# EAGLE design cradle_venus (EAGLE 9.6.2)
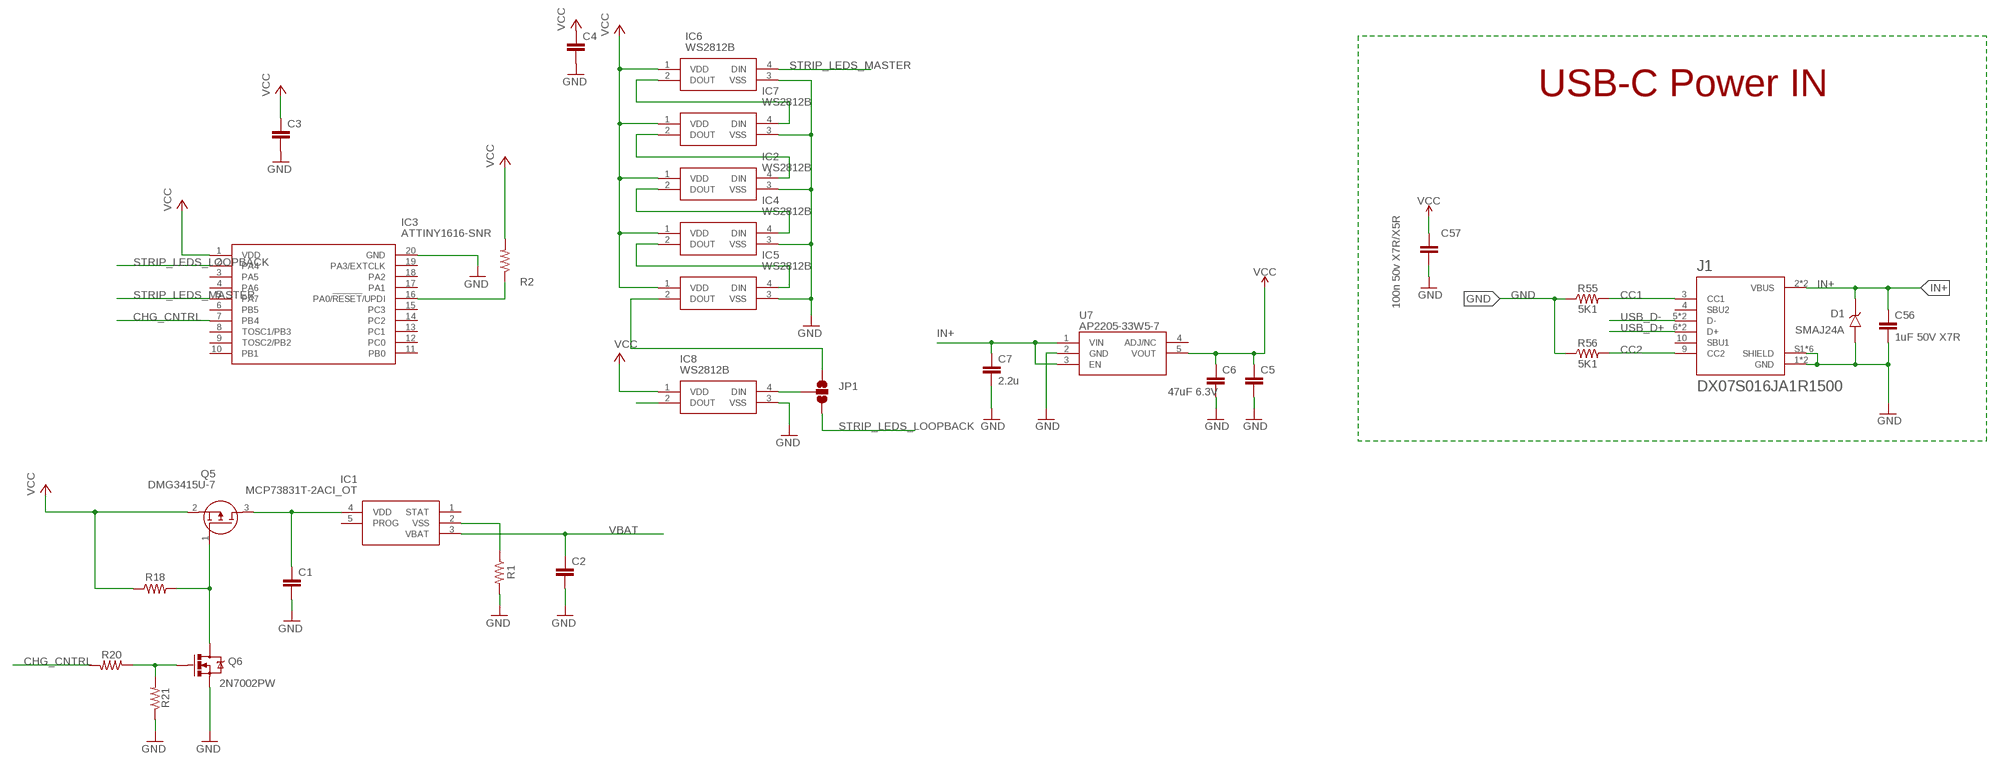
[diagram p0: schematic, sheet 1]

## Parts
C1  C-EUC0805  [C0805]
C2  C-EUC0805  [C0805]
C3  C-EUC0805  [C0805]
C4  C-EUC0805  [C0805]
C5  C-EUC0805  [C0805]
C6  47uF 6.3V  4.7UF-6.3V-10%(0603)0603  [0603-CAP]
C7  2.2u  4.7UF-6.3V-10%(0603)0603  [0603-CAP]
C56  1uF 50V X7R  CAP0805  [0805]
C57  100n 50v X7R/X5R  CAP0805  [0805]
D1  SMAJ24A  3SMAJ5934B  [DIOM4325X244N]
IC1  MCP73831T-2ACI_OT  [SOT95P270X145-5N]
IC2  WS2812B  [WS2812B]
IC3  ATTINY1616-SNR  [SOIC127P1030X265-20N]
IC4  WS2812B  [WS2812B]
IC5  WS2812B  [WS2812B]
IC6  WS2812B  [WS2812B]
IC7  WS2812B  [WS2812B]
IC8  WS2812B  [WS2812B]
J1  DX07S016JA1R1500  [JAE_DX07S016JA1R1500]
JP1  JUMPER-SMT_3_NO_SILK  [SMT-JUMPER_3_NO_SILK]
Q5  DMG3415U-7  SSM3J338R,LF  [SSM3J332RLFT]
Q6  2N7002PW  MOSFET-NCHANNEL2N7002PW  [SOT323]
R1  RESISTOR0805  [0805]
R2  RESISTOR0805  [0805]
R18  RESISTOR0805  [0805]
R20  RESISTOR0805  [0805]
R21  RESISTOR0805  [0805]
R55  5K1  RESISTOR0805  [0805]
R56  5K1  RESISTOR0805  [0805]
U7  AP2205-33W5-7  AP2205-W5-7  [SOT95P282X145-5N]

## Nets
CC1: J1.3(CC1) R55.2
CC2: J1.9(CC2) R56.2
CHG_CNTRL: IC3.7(PB4) R20.2
GND: C1.2 C2.2 C3.2 C4.2 C5.2 C6.2 C7.2 C56.2 C57.2 D1.A IC2.3(VSS) IC3.20(GND) IC4.3(VSS) IC5.3(VSS) IC6.3(VSS) IC7.3(VSS) IC8.3(VSS) J1.1(GND) J1.12(GND) J1.S1(SHIELD) J1.S2(SHIELD) J1.S3(SHIELD) J1.S4(SHIELD) J1.S5(SHIELD) J1.S6(SHIELD) Q6.2(S) R1.2 R21.1 R55.1 R56.1 U7.2(GND)
IN+: C7.1 C56.1 D1.C(K) J1.2(VBUS) J1.11(VBUS) U7.1(VIN) U7.3(EN)
N$1: C1.1 IC1.4(VDD) Q5.3(D)
N$2: IC6.2(DOUT) IC7.4(DIN)
N$3: IC1.2(VSS) R1.1
N$4: IC3.16(PA0/!RESET!/UPDI) R2.1
N$5: IC2.2(DOUT) IC4.4(DIN)
N$6: IC4.2(DOUT) IC5.4(DIN)
N$7: Q6.1(G) R20.1 R21.2
N$8: IC2.4(DIN) IC7.2(DOUT)
N$9: IC8.4(DIN) JP1.2
N$10: IC5.2(DOUT) JP1.1
N$11: IC8.2(DOUT)
N$12: Q5.1(G) Q6.3(D) R18.2
STRIP_LEDS_LOOPBACK: IC3.2(PA4) JP1.3
STRIP_LEDS_MASTER: IC3.5(PA7) IC6.4(DIN)
USB_D+: J1.6(D+) J1.7(D+)
USB_D-: J1.5(D-) J1.8(D-)
VBAT: C2.1 IC1.3(VBAT)
VCC [highpower]: C3.1 C4.1 C5.1 C6.1 C57.1 IC2.1(VDD) IC3.1(VDD) IC4.1(VDD) IC5.1(VDD) IC6.1(VDD) IC7.1(VDD) IC8.1(VDD) Q5.2(S) R2.2 R18.1 U7.5(VOUT)
Unconnected: IC1.1(STAT) IC1.5(PROG) IC3.3(PA5) IC3.4(PA6) IC3.6(PB5) IC3.8(TOSC1/PB3) IC3.9(TOSC2/PB2) IC3.10(PB1) IC3.11(PB0) IC3.12(PC0) IC3.13(PC1) IC3.14(PC2) IC3.15(PC3) IC3.17(PA1) IC3.18(PA2) IC3.19(PA3/EXTCLK) J1.4(SBU2) J1.10(SBU1) U7.4(ADJ/NC)

## Notes on the sheet
- USB-C Power IN

## Library data of the parts
C1-C5 = resistor:C-EU: CAPACITOR, European symbol
C6 C7 = SparkFun-Capacitors:4.7UF-6.3V-10%(0603): CAP-08280; PROD_ID: CAP-08280; VALUE: 4.7uF
C56 C57 = SparkFun-Passives:CAP: Capacitor Standard 0603 ceramic capacitor, and 0.1" leaded capacitor.
D1 = 3SMAJ5934B:3SMAJ5934B: Check availability <https://pricing.snapeda.com/parts/3SMAJ5934B/Micro%20Commercial%20Components/view-part?ref=eda>; AVAILABILITY: Not in stock; DESCRIPTION: Zener Diode Single 24V 5% 19Ohm 3000mW 2-Pin SMA T/R; MF: Micro Commercial Components; MP: 3SMAJ5934B; PACKAGE: None; PRICE: None
IC1 = SamacSys_Parts:MCP73831T-2ACI_OT: Li-Ion Charge Controller 4.2V SOT23-5 Source: Datasheet <http://ww1.microchip.com/downloads/en/DeviceDoc/20001984g.pdf>; ARROW_PART_NUMBER: MCP73831T-2ACI/OT; ARROW_PRICE-STOCK: https://www.arrow.com/en/products/mcp73831t-2aciot/microchip-technology?utm_currency=USD&region=europe; DESCRIPTION: Li-Ion Charge Controller 4.2V SOT23-5; HEIGHT: 1.45mm; MANUFACTURER_NAME: Microchip; MANUFACTURER_PART_NUMBER: MCP73831T-2ACI/OT; MOUSER_PART_NUMBER: 579-MCP73831T-2ACIOT; MOUSER_PRICE-STOCK: https://www.mouser.co.uk/ProductDetail/Microchip-Technology/MCP73831T-2ACI-OT?qs=yUQqVecv4qvbBQBGbHx0Mw%3D%3D
IC2 IC4-IC8 = SamacSys_Parts:WS2812B: NeoPixel 5050 RGB LED with Integrated Driver Chip - 10 Pack Source: Datasheet <https://cdn-shop.adafruit.com/datasheets/WS2812B.pdf>; DESCRIPTION: NeoPixel 5050 RGB LED with Integrated Driver Chip - 10 Pack; HEIGHT: 1.62mm; MANUFACTURER_NAME: Adafruit; MANUFACTURER_PART_NUMBER: WS2812B
IC3 = SamacSys_Parts:ATTINY1616-SNR: 8-bit Microcontrollers - MCU 20MHZ SOIC 85C GRN Source: Datasheet <https://datasheet.datasheetarchive.com/originals/distributors/DKDS41/DSANUWW0026757.pdf>; ARROW_PART_NUMBER: ATTINY1616-SNR; ARROW_PRICE-STOCK: https://www.arrow.com/en/products/attiny1616-snr/microchip-technology?utm_currency=USD&region=nac; DESCRIPTION: 8-bit Microcontrollers - MCU 20MHZ SOIC 85C GRN; HEIGHT: 2.65mm; MANUFACTURER_NAME: Microchip; MANUFACTURER_PART_NUMBER: ATTINY1616-SNR; MOUSER_PART_NUMBER: 556-ATTINY1616SNR; MOUSER_PRICE-STOCK: https://www.mouser.co.uk/ProductDetail/Microchip-Technology/ATTINY1616-SNR?qs=HXFqYaX1Q2w711d4DTfCdw%3D%3D
J1 = DX07S016JA1R1500:DX07S016JA1R1500: USB-C (USB TYPE-C) USB 2.0 Receptacle Connector 24 (16+8 Dummy) Position Surface Mount, Right Angle; Through Hole; DESCRIPTION: USB-C (USB TYPE-C) USB 2.0 Receptacle Connector 24 (16+8 Dummy) Position Surface Mount, Right Angle; Through Hole; DIGI-KEY_PART_NUMBER: 670-DX07S016JA1R1500CT-ND; MF: JAE Electronics; MP: DX07S016JA1R1500; PACKAGE: None; PURCHASE-URL: https://pricing.snapeda.com/search/part/DX07S016JA1R1500/?ref=eda
JP1 = SparkFun-Jumpers:JUMPER-SMT_3_NO: Normally open jumper This jumper has three pads in close proximity to each other. Apply solder to close the connection(s).
Q5 = SSM3J338R_LF:SSM3J338R,LF: MOSFET Small-signal MOSFET Vdss= -12V, ID= -6A Source: Datasheet <http://toshiba.semicon-storage.com/info/docget.jsp?did=30384&prodName=SSM3J338R>; ARROW_PART_NUMBER: SSM3J338R,LF; ARROW_PRICE-STOCK: https://www.arrow.com/en/products/ssm3j338rlf/toshiba?region=nac; DESCRIPTION: MOSFET Small-signal MOSFET Vdss= -12V, ID= -6A; HEIGHT: mm; MANUFACTURER_NAME: Toshiba; MANUFACTURER_PART_NUMBER: SSM3J338R,LF; MOUSER_PART_NUMBER: 757-SSM3J338RLF; MOUSER_PRICE-STOCK: https://www.mouser.co.uk/ProductDetail/Toshiba/SSM3J338RLF?qs=lhkzy8lC%252BSvURFM9ZjmJSw%3D%3D
Q6 = SparkFun-DiscreteSemi:MOSFET-NCHANNEL: Common NMOSFET Parts MFG P/N Store ID Prod ID FDD8780 TRANS-09984 SI7820DN TRANS-11055 FDS6630A IC-08089 2N7002PW TRANS-11151 FQP30N06L COM-10213 TRANS-10060 BSS123LT1G TRANS-08345 BSS138 TRANS-00830 BS170 2N7000; PROD_ID: TRANS-11151
R1 R2 R18 R20 R21 R55 R56 = SparkFun-Resistors:RESISTOR: Generic Resistor Package
U7 = AP2205-W5-7:AP2205-W5-7: LDO Voltage Regulators LDO CMOS LowCurr Source: Datasheet <https://www.diodes.com/assets/Datasheets/AP2206.pdf>; DESCRIPTION: LDO Voltage Regulators LDO CMOS LowCurr; HEIGHT: 1.45mm; MANUFACTURER_NAME: Diodes Inc.; MANUFACTURER_PART_NUMBER: AP2205-W5-7; MOUSER_PART_NUMBER: 621-AP2205-W5-7; MOUSER_PRICE-STOCK: https://www.mouser.com/Search/Refine.aspx?Keyword=621-AP2205-W5-7

## Net classes
1 highpower: width 0.254 mm, drill 0.483 mm

## Board
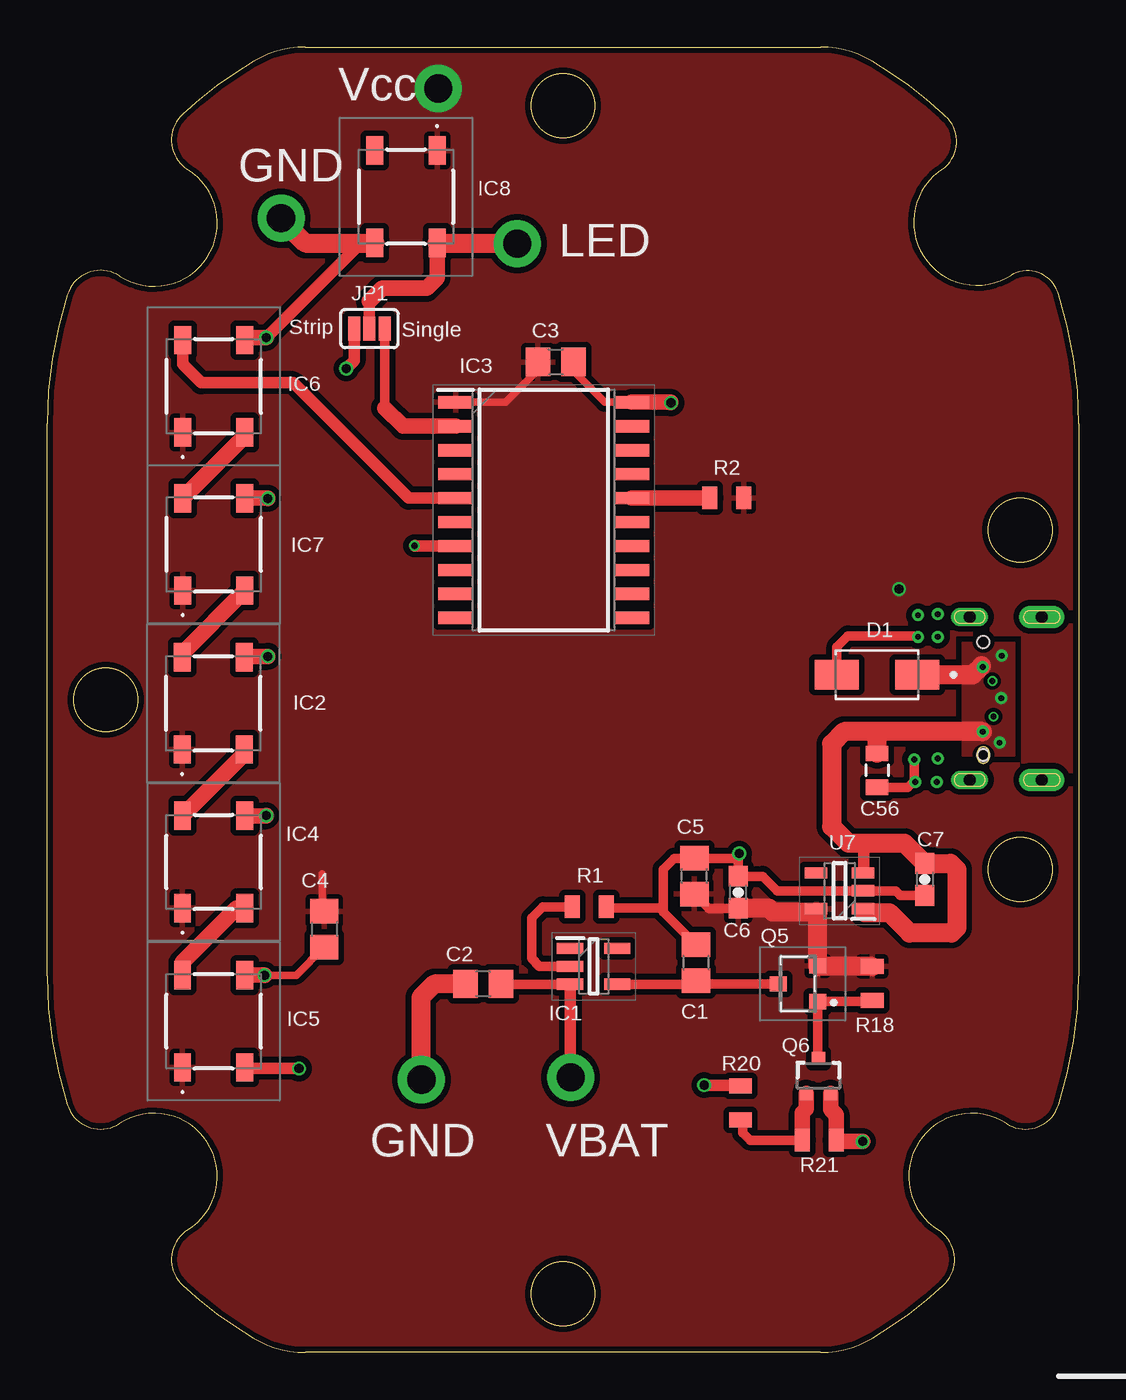
[diagram p1: board, top side]
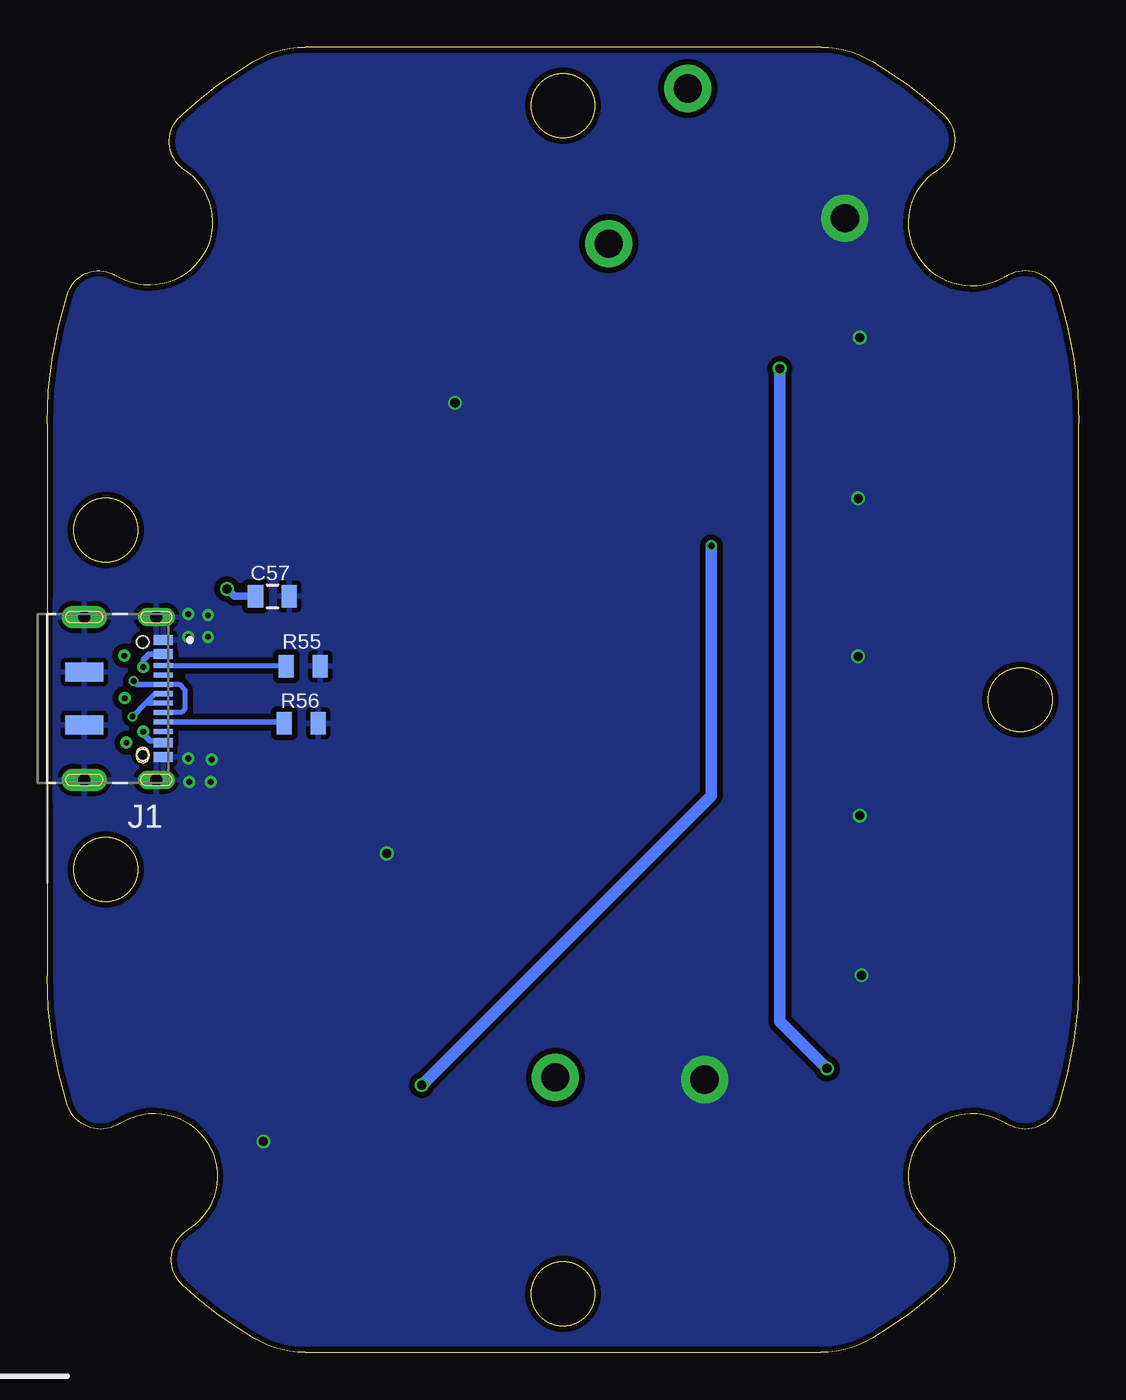
[diagram p2: board, bottom side, seen from below]

Size 54.7 x 69.23 mm. Coordinates in mm from the lower left corner, seen from the top.
Outline: 54.7,49.25 54.7,19.98 arc-18 53.62,13.12 arc-105 50.85,12.14 arc181 47.25,6.49 arc-105 47.52,3.57 arc-12 43.74,0.75 arc-31 41.01,0 13.69,0 arc-31 10.96,0.75 arc-12 7.18,3.57 arc-105 7.45,6.49 arc181 3.85,12.14 arc-105 1.08,13.12 arc-18 0,19.98 0,49.25 arc-18 1.08,56.1 arc-105 3.85,57.09 arc181 7.45,62.74 arc-105 7.18,65.66 arc-12 10.96,68.48 arc-31 13.69,69.23 41.01,69.23 arc-31 43.74,68.48 arc-12 47.52,65.66 arc-105 47.51,62.79 arc181 51.11,57.14 arc-105 53.62,56.1 arc-18 54.7,49.25
Outline: circle at 27.35,66.13 radius 1.7
Outline: circle at 51.6,43.61 radius 1.7
Outline: circle at 27.35,3.1 radius 1.7
Outline: circle at 3.1,34.61 radius 1.7
Outline: circle at 51.6,25.61 radius 1.7
Copper layers (1*16): Top 0.035mm / dielectric 1.5mm / Bottom 0.035mm
Design rules "default *": minimum track width 8mil, minimum drill 12mil, track to track 8mil, track to pad 8mil, pad to pad 8mil, via to via 8mil, smd to smd 0mil, copper to edge 10mil, drill to drill 8mil, minimum pad ring 6mil, minimum via ring 4mil, stop-mask expansion 4mil, vias tented up to drill 0mil, thermal gap 10mil

### Footprints (pad centres in the part's own frame; a part is rotated, then mirrored left to right if it is on the bottom)
C0805 = smd 1.3 x 1.5: 1 -0.95,0; 2 0.95,0
0603-CAP = smd 1.1 x 1: 1 -0.85,0; 2 0.85,0
0805 = smd 0.8 x 1.2: 1 -0.9,0; 2 0.9,0
DIOM4325X244N = smd 2.33 x 1.55: A 2.135,0; C -2.135,0
SOT95P270X145-5N = smd 1.4 x 0.6: 1 -1.25,0.95; 2 -1.25,0; 3 -1.25,-0.95; 4 1.25,-0.95; 5 1.25,0.95
WS2812B = smd 1.5 x 0.9: 1 -2.45,1.65; 2 -2.45,-1.65; 3 2.45,-1.65; 4 2.45,1.65
SOIC127P1030X265-20N = smd 1.85 x 0.65: 1 -4.675,5.715; 2 -4.675,4.445; 3 -4.675,3.175; 4 -4.675,1.905; 5 -4.675,0.635; 6 -4.675,-0.635; 7 -4.675,-1.905; 8 -4.675,-3.175; 9 -4.675,-4.445; 10 -4.675,-5.715; 11 4.675,-5.715; 12 4.675,-4.445; 13 4.675,-3.175; 14 4.675,-1.905; 15 4.675,-0.635; 16 4.675,0.635; 17 4.675,1.905; 18 4.675,3.175; 19 4.675,4.445; 20 4.675,5.715
JAE_DX07S016JA1R1500 = smd 0.52 x 1: 1 -3.1,1.1; 2 -2.35,1.1; 11 2.35,1.1; 12 3.1,1.1 | smd 0.27 x 1: 3 -1.75,1.1; 4 -1.25,1.1; 5 -0.75,1.1; 6 -0.25,1.1; 7 0.25,1.1; 8 0.75,1.1; 9 1.25,1.1; 10 1.75,1.1 | smd 1 x 2: S1 -1.4,-3.1; S2 1.4,-3.1 | drill 0.65 long: S3 -4.32,0.725; S4 4.32,0.725 | drill 0.65 pad 1.2 long: S5 -4.32,-3.1; S6 4.32,-3.1 | hole 0.6: 3,0 | hole 0.63: 3,0; -3,0
SMT-JUMPER_3_NO_SILK = smd 0.635 x 1.27: 1 -0.813,0; 2 0,0; 3 0.813,0
SSM3J332RLFT = smd 0.8 x 0.9: 1 -0.95,-1.05; 2 0.95,-1.05; 3 0,1.05
SOT323 = smd 0.7 x 0.7: 1 -0.65,-0.925; 2 0.65,-0.925; 3 0,0.925
SOT95P282X145-5N = smd 1.2 x 0.6: 1 -1.25,0.95; 2 -1.25,0; 3 -1.25,-0.95; 4 1.25,-0.95; 5 1.25,0.95

### Placement (x,y rotation side)
C1  34.41,20.67 90 top
C2  23.13,19.54 180 top
C3  100n  [C0805]  26.97,52.53 0 top
C4  100n  [C0805]  14.7,22.44 270 top
C5  34.32,25.25 90 top
C6  36.65,24.4 90 top
C7  46.53,25.08 270 top
C56  44.01,30.87 270 top
C57  42.76,40.1 0 bottom
D1  44.01,35.94 180 top
IC1  28.98,20.47 0 top
IC2  8.81,34.42 90 top
IC3  26.33,44.67 0 top
IC4  8.83,26.01 90 top
IC5  8.83,17.56 90 top
IC6  8.84,51.24 90 top
IC7  8.84,42.85 90 top
IC8  19.03,61.29 270 top
J1  49.64,34.68 270 bottom
JP1  17.09,54.3 0 top
Q5  39.81,19.55 90 top
Q6  40.9,14.66 0 top
R1  28.75,23.63 0 top
R2  36.04,45.32 0 top
R18  43.75,19.56 270 top
R20  100R  [0805]  36.77,13.24 90 top
R21  100K  [0805]  40.94,11.25 180 top
R55  41.13,36.39 180 bottom
R56  41.23,33.36 180 bottom
U7  42.02,24.48 180 top

### Tracks (layer width: path | path; a pad name or v marks a point on that pad's centre or on a via)
CC1
  Bottom 0.254: J1.3 42.07,36.43
  Bottom 0.305: 42.07,36.43 R55.2
CC2
  Bottom 0.305: J1.9 42.2,33.43 R56.2
CHG_CNTRL  (via drill 0.35, 0.48)
  Top 0.61: IC3.7 19.5,42.77 v19.49,42.78 | v34.84,14.17 36.74,14.17 R20.2
  Bottom 0.61: v19.49,42.78 19.49,29.52 v34.84,14.17
GND  (via drill 0.3 pad 0.64, 0.48, 1.5 pad 2.5)
  Top 0.406: C3.2 27.92,52.03 29.56,50.39 IC3.20 | v11.53,20 13.21,20 C4.2
  Top 0.508: D1.A 41.87,37.42 42.46,38 46.12,38 v46.17,37.95 | C56.2 45.63,29.97 45.97,30.31 v45.97,31.45 | C7.2 45.24,24.23 44.99,24.48 U7.2 38.71,24.48 37.94,25.25 C6.2 36.65,26.41 v36.7,26.46 36.44,26.2 C5.2 33.24,26.2 32.66,25.62 32.66,23.58 | 32.66,23.58 32.66,23.37 C1.2 | 32.66,23.58 29.7,23.58 R1.2 | 19.82,14.49 v19.84,14.46
  Top 0.61: v11.62,53.82 16.64,58.84 IC8.3
  Top 0.813: Q6.2 41.55,12.89 41.84,12.6 R21.1 41.91,11.18 v43.24,11.18 | IC3.20 33.05,50.39 v33.08,50.36 | IC6.3 10.62,53.82 v11.62,53.82 | IC7.3 v11.7,45.3 v11.71,45.29 | IC2.3 10.5,36.91 v11.71,36.91 | IC4.3 v11.61,28.46 v11.62,28.47 | IC5.3 v11.52,20.01 v11.53,20
  Top 1.016: C2.2 20.54,19.54 19.82,18.82 19.82,14.49 | IC8.3 13.69,58.84 12.41,60.12 v12.41,60.16
  other vias: 47.22,31.5 47.17,30.25 46.02,30.25 47.22,39.15 47.22,37.95 46.17,39.1
  pour Bottom (isolate 0.254): 45.64,37.29 45.64,39.89 54.51,39.89 54.51,29.29 54.48,29.26 45.74,29.26 45.66,29.34 45.66,32.09 47.96,32.09 47.96,31.54 51.96,31.54 51.96,37.39 51.61,37.74 49.51,37.74 49.06,37.29
  pour Bottom (isolate 0.305): -2.36,-1.26 57.64,-1.26 57.64,70.74 -2.36,70.74
IN+  (via drill 0.3 pad 0.64)
  Top 0.203: U7.1 43.34,23.46 43.34,23.32
  Top 0.61: U7.3 43.29,25.45 43.29,26.99
  Top 1.016: D1.C 49.08,35.94 49.54,36.4 | C56.1 44.01,32.92 | 44.01,32.92 42.24,32.92 41.6,32.27 41.6,27.89 42.5,26.99 43.29,26.99 45.47,26.99 C7.1 47.91,25.93 48.24,25.6 48.24,22.52 47.96,22.24 45.73,22.24 44.65,23.32 43.34,23.32 | v49.6,32.92 44.01,32.92
  Bottom 0.305: v49.6,36.34 49.6,36.71 49.29,37.03 J1.2 | v49.6,32.92 49.57,32.89 49.57,32.76 49.24,32.43 48.64,32.43 J1.11
  other vias: 50.5,32.33 50.61,36.95 50.59,34.69
  pour Top: 48.53,31.63 48.53,37.65 51.3,37.65 51.3,31.63
N$1
  Top 0.508: Q5.3 34.58,19.55 C1.1 34.21,19.52 IC1.4
N$2
  Top 0.813: IC7.4 10.49,48.6 IC6.2
N$3
  Top 0.508: IC1.2 26.1,20.47 25.69,20.88 25.69,23.03 26.29,23.63 R1.1
N$4
  Top 0.813: IC3.16 35.12,45.31 R2.1
N$5
  Top 0.813: IC4.4 10.46,31.74 IC2.2
N$6
  Top 0.813: IC5.4 7.18,20.69 10.05,23.56 IC4.2
N$7
  Top 0.508: R20.1 36.88,12.23 36.88,11.64 37.27,11.25 R21.2 | 40.25,12.91 40.04,12.7
  Top 0.813: R21.2 40.04,12.7 | 40.25,12.91 Q6.1
N$8
  Top 0.813: IC2.4 7.16,37.07 IC7.2
N$9  (via drill 1.5 pad 2.5)
  Top 0.61: JP1.2 17.09,55.74
  Top 0.813: IC8.4 20.68,56.99 20.12,56.43 17.78,56.43 17.09,55.74
  Top 1.016: IC8.4 24.89,58.84 v24.93,58.81
N$10  (via drill 0.48)
  Top 0.61: JP1.1 16.27,52.59 v15.86,52.17 | v13.36,15.05 10.54,15.05 IC5.2
  Bottom 0.61: v15.86,52.17 15.86,17.55 v13.36,15.05
N$12
  Top 0.508: Q6.3 40.86,15.63 Q5.1 43.69,18.6 R18.2
STRIP_LEDS_LOOPBACK
  Top 0.508: JP1.3 17.9,50.09
  Top 0.813: IC3.2 18.87,49.12 17.9,50.09
STRIP_LEDS_MASTER
  Top 0.61: IC3.5 19.17,45.31 13.05,51.43 8.17,51.43 7.19,52.41 IC6.4
USB_D+  (via drill 0.3)
  Bottom 0.254: J1.6 48.96,34.93 49.49,34.4
  Bottom 0.305: J1.7 49.46,34.43 49.49,34.4 v50.17,33.72
USB_D-  (via drill 0.3)
  Bottom 0.254: 48.5,35.4 J1.5 47.7,35.44 47.4,35.13 47.4,34.13 47.58,33.95 48.52,33.95 J1.8
  Bottom 0.305: J1.5 49.94,35.43 v50.11,35.61
VBAT  (via drill 1.5 pad 2.5)
  Top 0.508: IC1.3 24.1,19.52 C2.1
  Top 0.61: IC1.3 27.73,14.62
  Top 1.016: v27.76,14.59 27.73,14.62
VCC  (via drill 0.48, 1.5 pad 2.5)
  Top 0.406: C3.1 26.02,52.09 24.31,50.39 IC3.1 | C4.1 14.59,23.5 14.59,25.38
  Top 0.508: C5.1 35.07,23.55 C6.1
  Top 1.016: R18.1 40.9,20.46 Q5.2 40.86,23.34 38.49,23.34 38.27,23.55 C6.1
  Bottom 0.406: C57.1 44.79,40.1 v45.17,40.48
  other vias: 20.74,67.04
  pour Top (isolate 0.305, rank 2): -2.36,-1.26 57.64,-1.26 57.64,70.74 -2.36,70.74

### Text on the board
tPlace: Vcc | GND | LED | Strip | Single | GND | VBAT